# EAGLE design mainBoard (EAGLE 9.0.1)

## Sheet 1 of 4
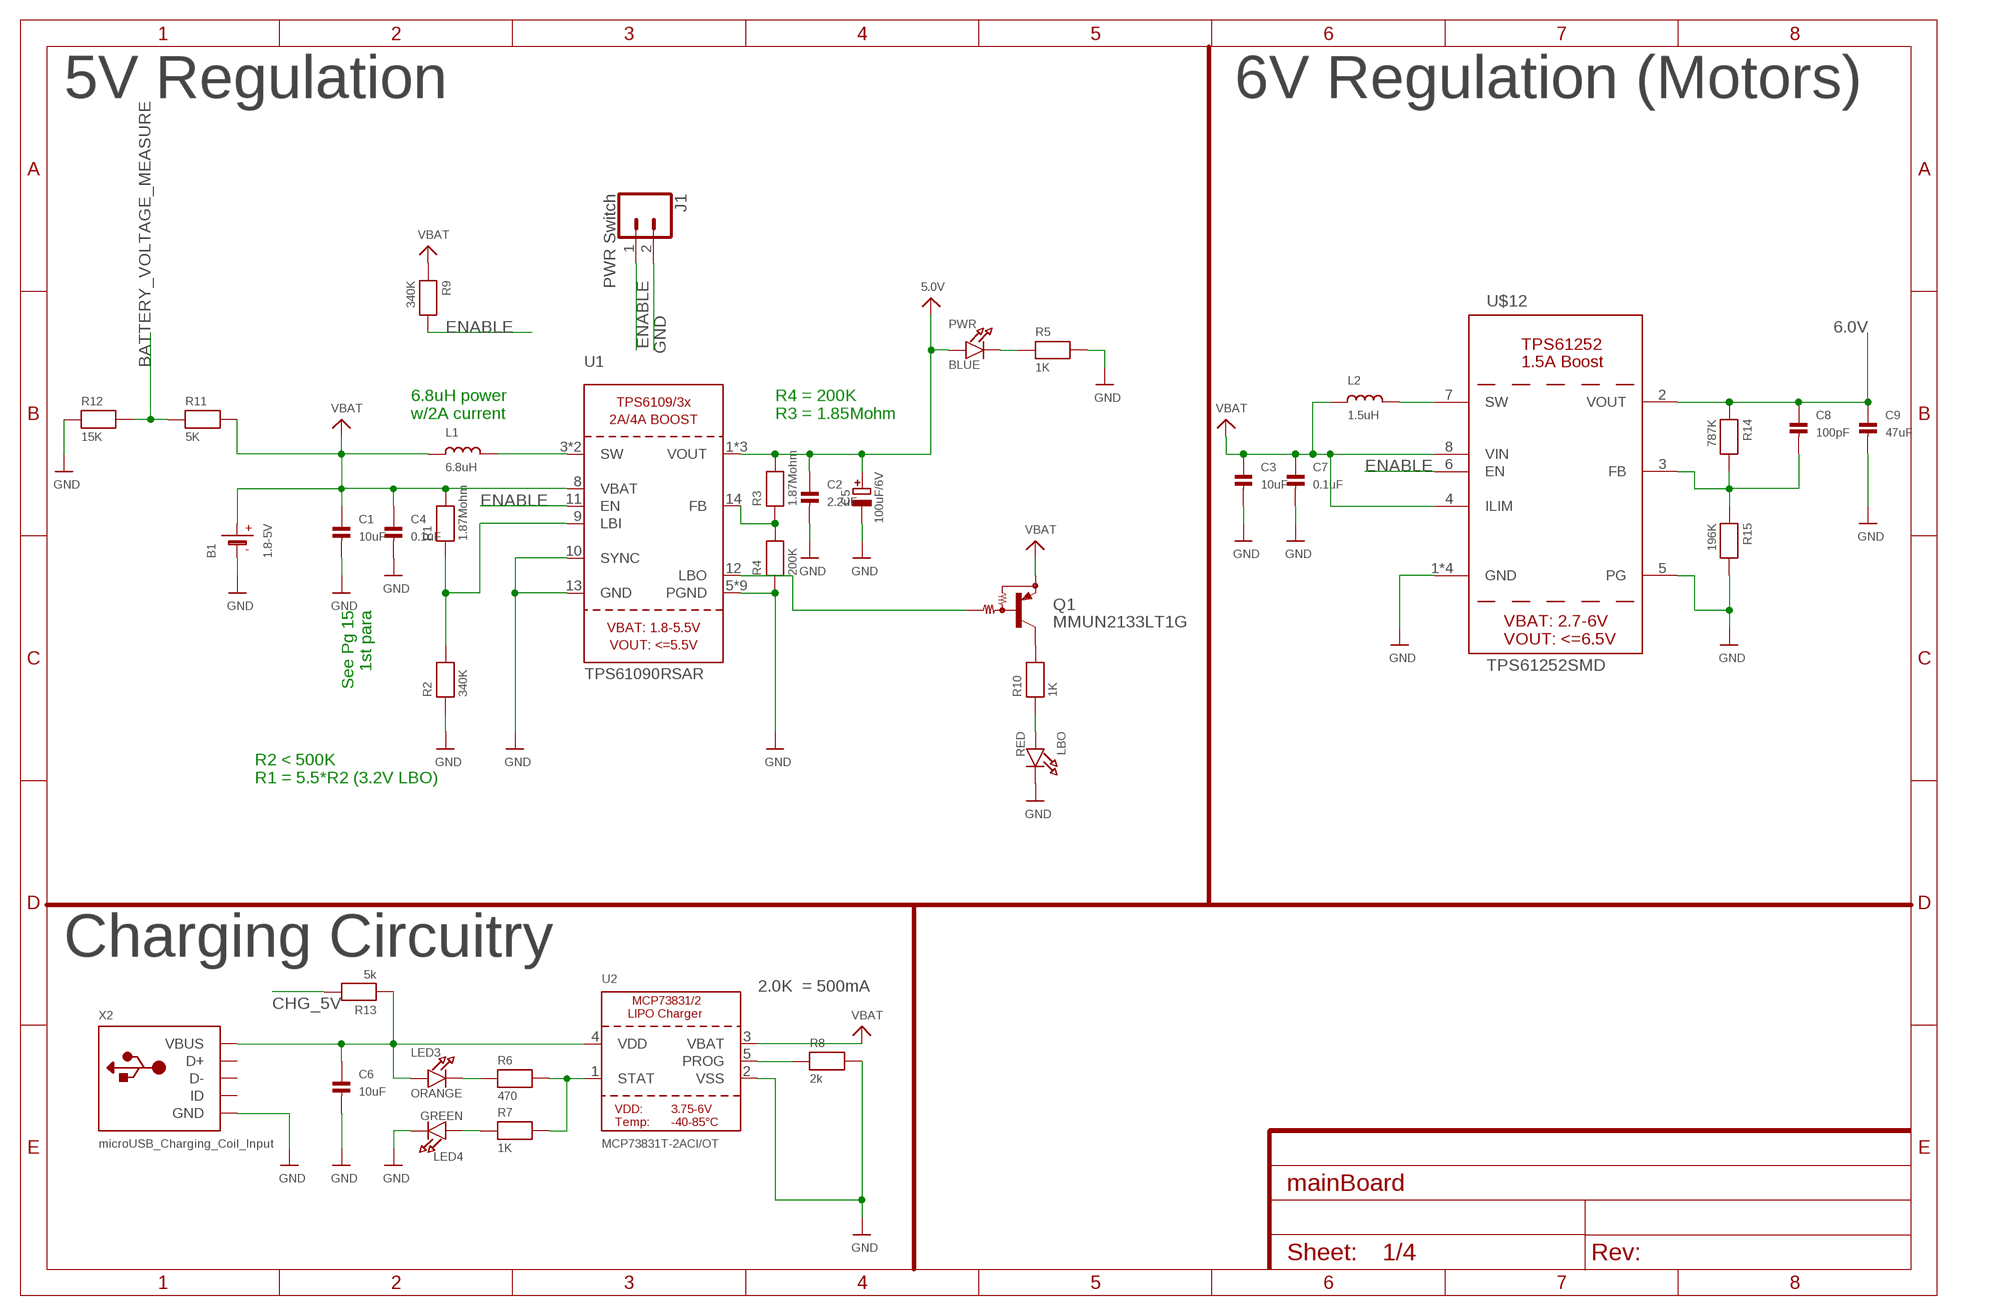
[diagram p0: schematic, sheet 1]
FRAME1 (FRAME-A4L): CNAME: Charging and Power Distribution; CREVISION: 1; DESIGNER: Sean Wilson

### Parts
B1  1.8-5V  BATTERY  [JSTPH2]
C1  10uF  CAP_CERAMIC0603  [0603]
C2  2.2uF  CAP_CERAMIC0603  [0603]
C3  10uF  CAP_CERAMIC0603  [0603]
C4  0.1uF  CAP_CERAMIC0805  [0805]
C5  100uF/6V  CAP_TANTALUMB/3528_REFLOW  [EIA3528-21/B-R]
C6  10uF  CAP_CERAMIC0603  [0603]
C7  0.1uF  CAP_CERAMIC0805  [0805]
C8  100pF  CAP_CERAMIC0603  [0603]
C9  47uF  CAP_CERAMIC1206  [1206]
J1  PWR Switch  CONN_02  [1X02]
L1  6.8uH  VISHAY_IHLP2525CZER6R8M01  [VISHAY_IHLP2525CZER6R8M01]
L2  1.5uH  MURATA_DFE252012P-1R5M=P2  [MURATA_DFE252012P-1R5M=P2]
LBO  RED  LED0805_NOOUTLINE  [CHIPLED_0805_NOOUTLINE]
LED3  ORANGE  LED0805_NOOUTLINE  [CHIPLED_0805_NOOUTLINE]
LED4  GREEN  LED0805_NOOUTLINE  [CHIPLED_0805_NOOUTLINE]
PWR  BLUE  LED0805_NOOUTLINE  [CHIPLED_0805_NOOUTLINE]
Q1  MMUN2133LT1G  MUN2114T1-PNP_DRIVER-SC59-BEC  [SC59-BEC]
R1  1.87Mohm  RESISTOR0805  [0805]
R2  340K  RESISTOR0805  [0805]
R3  1.87Mohm  RESISTOR0805  [0805]
R4  200K  RESISTOR0805  [0805]
R5  1K  RESISTOR0805  [0805]
R6  470  RESISTOR0805  [0805]
R7  1K  RESISTOR0805  [0805]
R8  2k  RESISTOR0805  [0805]
R9  340K  RESISTOR0805  [0805]
R10  1K  RESISTOR0805  [0805]
R11  5K  RESISTOR0805  [0805]
R12  15K  RESISTOR0805  [0805]
R13  5k  RESISTOR0805  [0805]
R14  787K  RESISTOR0805  [0805]
R15  196K  RESISTOR0805  [0805]
U1  TPS61090RSAR  VREG_TPS6103X  [PVQFN-16]
U2  MCP73831T-2ACI/OT  MCP73831/2  [SOT23-5]
U$12  TPS61252SMD  [TPS61252]
X2  microUSB_Charging_Coil_Input  USBMICRO_20329  [4UCONN_20329]

### Nets
5.0V: C2.1 C5.+ PWR.A R3.2 U1.1(VOUT) U1.15(VOUT) U1.16(VOUT) ; also sheet 2,3,4
6.0V: C8.1 C9.1 R14.1 U$12.2(VOUT) ; also sheet 3
BATTERY_VOLTAGE_MEASURE: R11.1 R12.2 ; also sheet 2
CHARGING_BOOL_5V: C6.1 LED3.A R13.1 U2.4(VDD) X2.VBUS
CHG_5V: R13.2 ; also sheet 2
ENABLE: J1.1 R9.2 U1.11(EN) U$12.6(EN)
GND: B1.1(-) C1.2 C2.2 C3.2 C4.2 C5.- C6.2 C7.2 C9.2 J1.2 LBO.C LED4.C R2.1 R4.1 R5.2 R8.2 R12.1 R15.2 U1.5(PGND) U1.6(PGND) U1.7(PGND) U1.10(SYNC) U1.13(GND) U1.P$18(PGND) U1.P$19(PGND) U1.P$20(PGND) U1.P$21(PGND) U1.P$22(PGND) U1.THERMAL(PGND) U2.2(VSS) U$12.1(GND) U$12.5(PG) U$12.P$2_GND(GND) U$12.P$3_GND(GND) U$12.THERMAL_GND(GND) X2.BASE@1(GND) X2.BASE@2(GND) X2.GND X2.SPRT@1(GND) X2.SPRT@2(GND) X2.SPRT@3(GND) X2.SPRT@4(GND) ; also sheet 2,3,4
LBO: Q1.B U1.12(LBO)
N$1: L1.P$2 U1.3(SW) U1.4(SW)
N$2: LBO.A R10.1
N$3: R1.1 R2.2 U1.9(LBI)
N$4: PWR.C R5.1
N$5: R3.1 R4.2 U1.14(FB)
N$6: LED3.C R6.1
N$7: R6.2 R7.2 U2.1(STAT)
N$8: R8.1 U2.5(PROG)
N$9: LED4.A R7.1
N$10: Q1.C R10.2
N$11: L2.P$2 U$12.7(SW)
N$12: C8.2 R14.2 R15.1 U$12.3(FB)
VBAT: B1.2(+) C1.1 C3.1 C4.1 C7.1 L1.P$1 L2.P$1 Q1.E R1.2 R9.1 R11.2 U1.8(VBAT) U2.3(VBAT) U$12.4(ILIM) U$12.8(VIN)
Unconnected: X2.D+ X2.D- X2.ID

### Notes on the sheet
- 5V Regulation | 6V Regulation (Motors)
- 6.8uH power
  w/2A current
- R4 = 200K
  R3 = 1.85Mohm
- See Pg 15
  1st para
- R2 < 500K
  R1 = 5.5*R2 (3.2V LBO)
- Charging Circuitry
- 2.0K  = 500mA

## Sheet 2 of 4
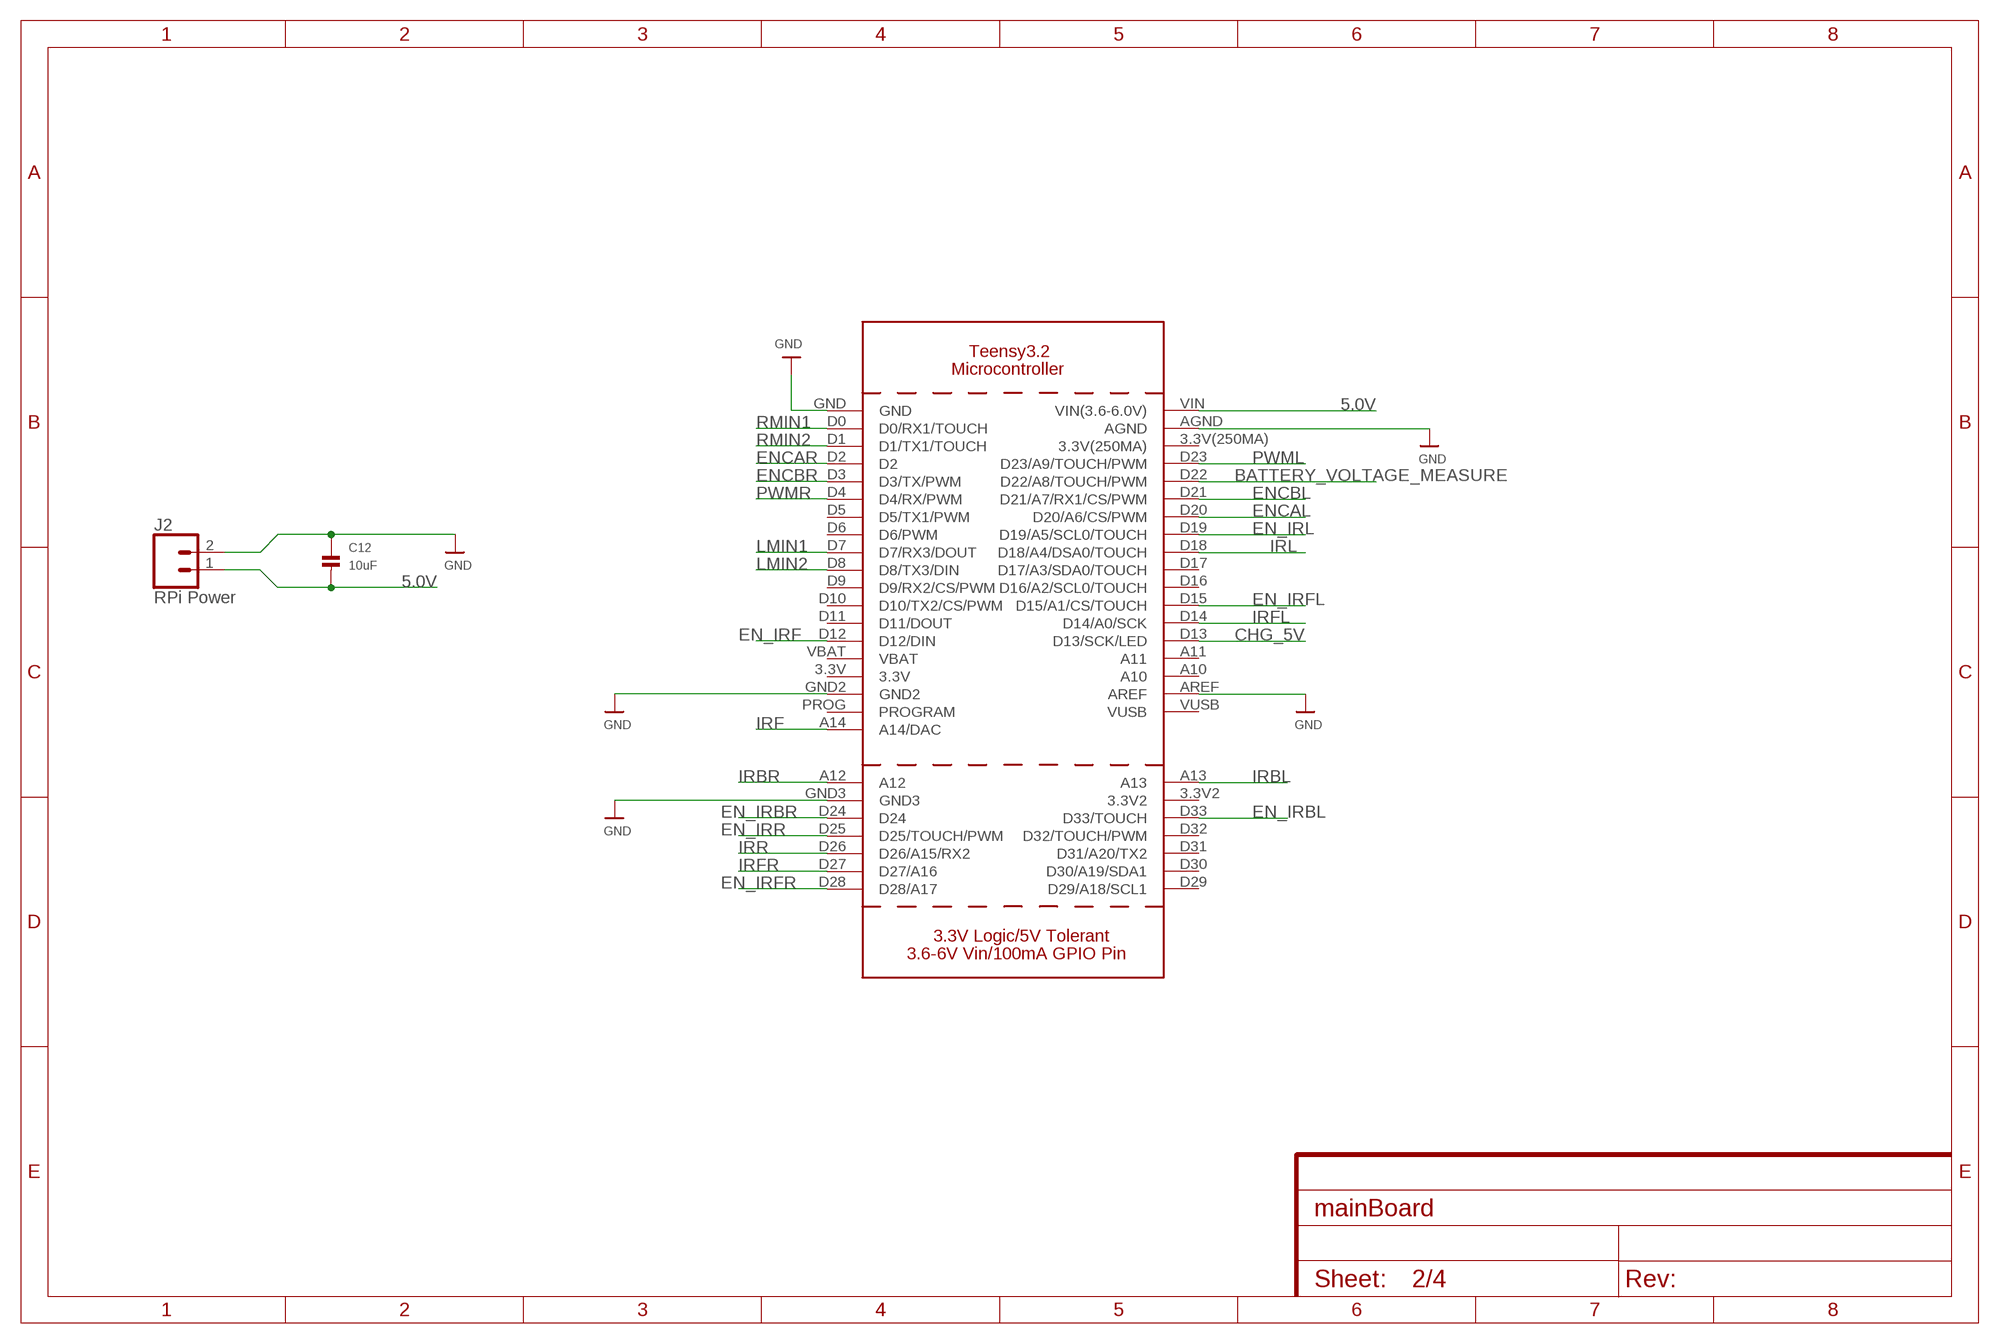
[diagram p1: schematic, sheet 2]
FRAME2 (FRAME-A4L): CNAME: Main Processor; CREVISION: 1; DESIGNER: Sean Wilson

### Parts
C12  10uF  CAP_CERAMIC0603  [0603]
J2  RPi Power  CONN_02  [1X02]
U$28  TEENSY3_2  [TEENSY3_2]

### Nets
5.0V: C12.2 J2.1 U$28.VIN(VIN(3.6-6.0V)) ; also sheet 1,3,4
BATTERY_VOLTAGE_MEASURE: U$28.D22(D22/A8/TOUCH/PWM) ; also sheet 1
CHG_5V: U$28.D13(D13/SCK/LED) ; also sheet 1
EN_IRBL: U$28.D33(D33/TOUCH) ; also sheet 4
EN_IRBR: U$28.D24 ; also sheet 4
EN_IRF: U$28.D12(D12/DIN) ; also sheet 4
EN_IRFL: U$28.D15(D15/A1/CS/TOUCH) ; also sheet 4
EN_IRFR: U$28.D28(D28/A17) ; also sheet 4
EN_IRL: U$28.D19(D19/A5/SCL0/TOUCH) ; also sheet 4
EN_IRR: U$28.D25(D25/TOUCH/PWM) ; also sheet 4
ENCAL: U$28.D20(D20/A6/CS/PWM) ; also sheet 3
ENCAR: U$28.D2 ; also sheet 3
ENCBL: U$28.D21(D21/A7/RX1/CS/PWM) ; also sheet 3
ENCBR: U$28.D3(D3/TX/PWM) ; also sheet 3
GND: C12.1 J2.2 U$28.AGND U$28.AREF U$28.GND U$28.GND2 U$28.GND3 ; also sheet 1,3,4
IRBL: U$28.A13 ; also sheet 4
IRBR: U$28.A12 ; also sheet 4
IRF: U$28.A14(A14/DAC) ; also sheet 4
IRFL: U$28.D14(D14/A0/SCK) ; also sheet 4
IRFR: U$28.D27(D27/A16) ; also sheet 4
IRL: U$28.D18(D18/A4/DSA0/TOUCH) ; also sheet 4
IRR: U$28.D26(D26/A15/RX2) ; also sheet 4
LMIN1: U$28.D7(D7/RX3/DOUT) ; also sheet 3
LMIN2: U$28.D8(D8/TX3/DIN) ; also sheet 3
PWML: U$28.D23(D23/A9/TOUCH/PWM) ; also sheet 3
PWMR: U$28.D4(D4/RX/PWM) ; also sheet 3
RMIN1: U$28.D0(D0/RX1/TOUCH) ; also sheet 3
RMIN2: U$28.D1(D1/TX1/TOUCH) ; also sheet 3
Unconnected: U$28.3.3V U$28.3.3V2 U$28.3.3V(250MA) U$28.A10 U$28.A11 U$28.D5(D5/TX1/PWM) U$28.D6(D6/PWM) U$28.D9(D9/RX2/CS/PWM) U$28.D10(D10/TX2/CS/PWM) U$28.D11(D11/DOUT) U$28.D16(D16/A2/SCL0/TOUCH) U$28.D17(D17/A3/SDA0/TOUCH) U$28.D29(D29/A18/SCL1) U$28.D30(D30/A19/SDA1) U$28.D31(D31/A20/TX2) U$28.D32(D32/TOUCH/PWM) U$28.PROG(PROGRAM) U$28.VBAT U$28.VUSB

## Sheet 3 of 4
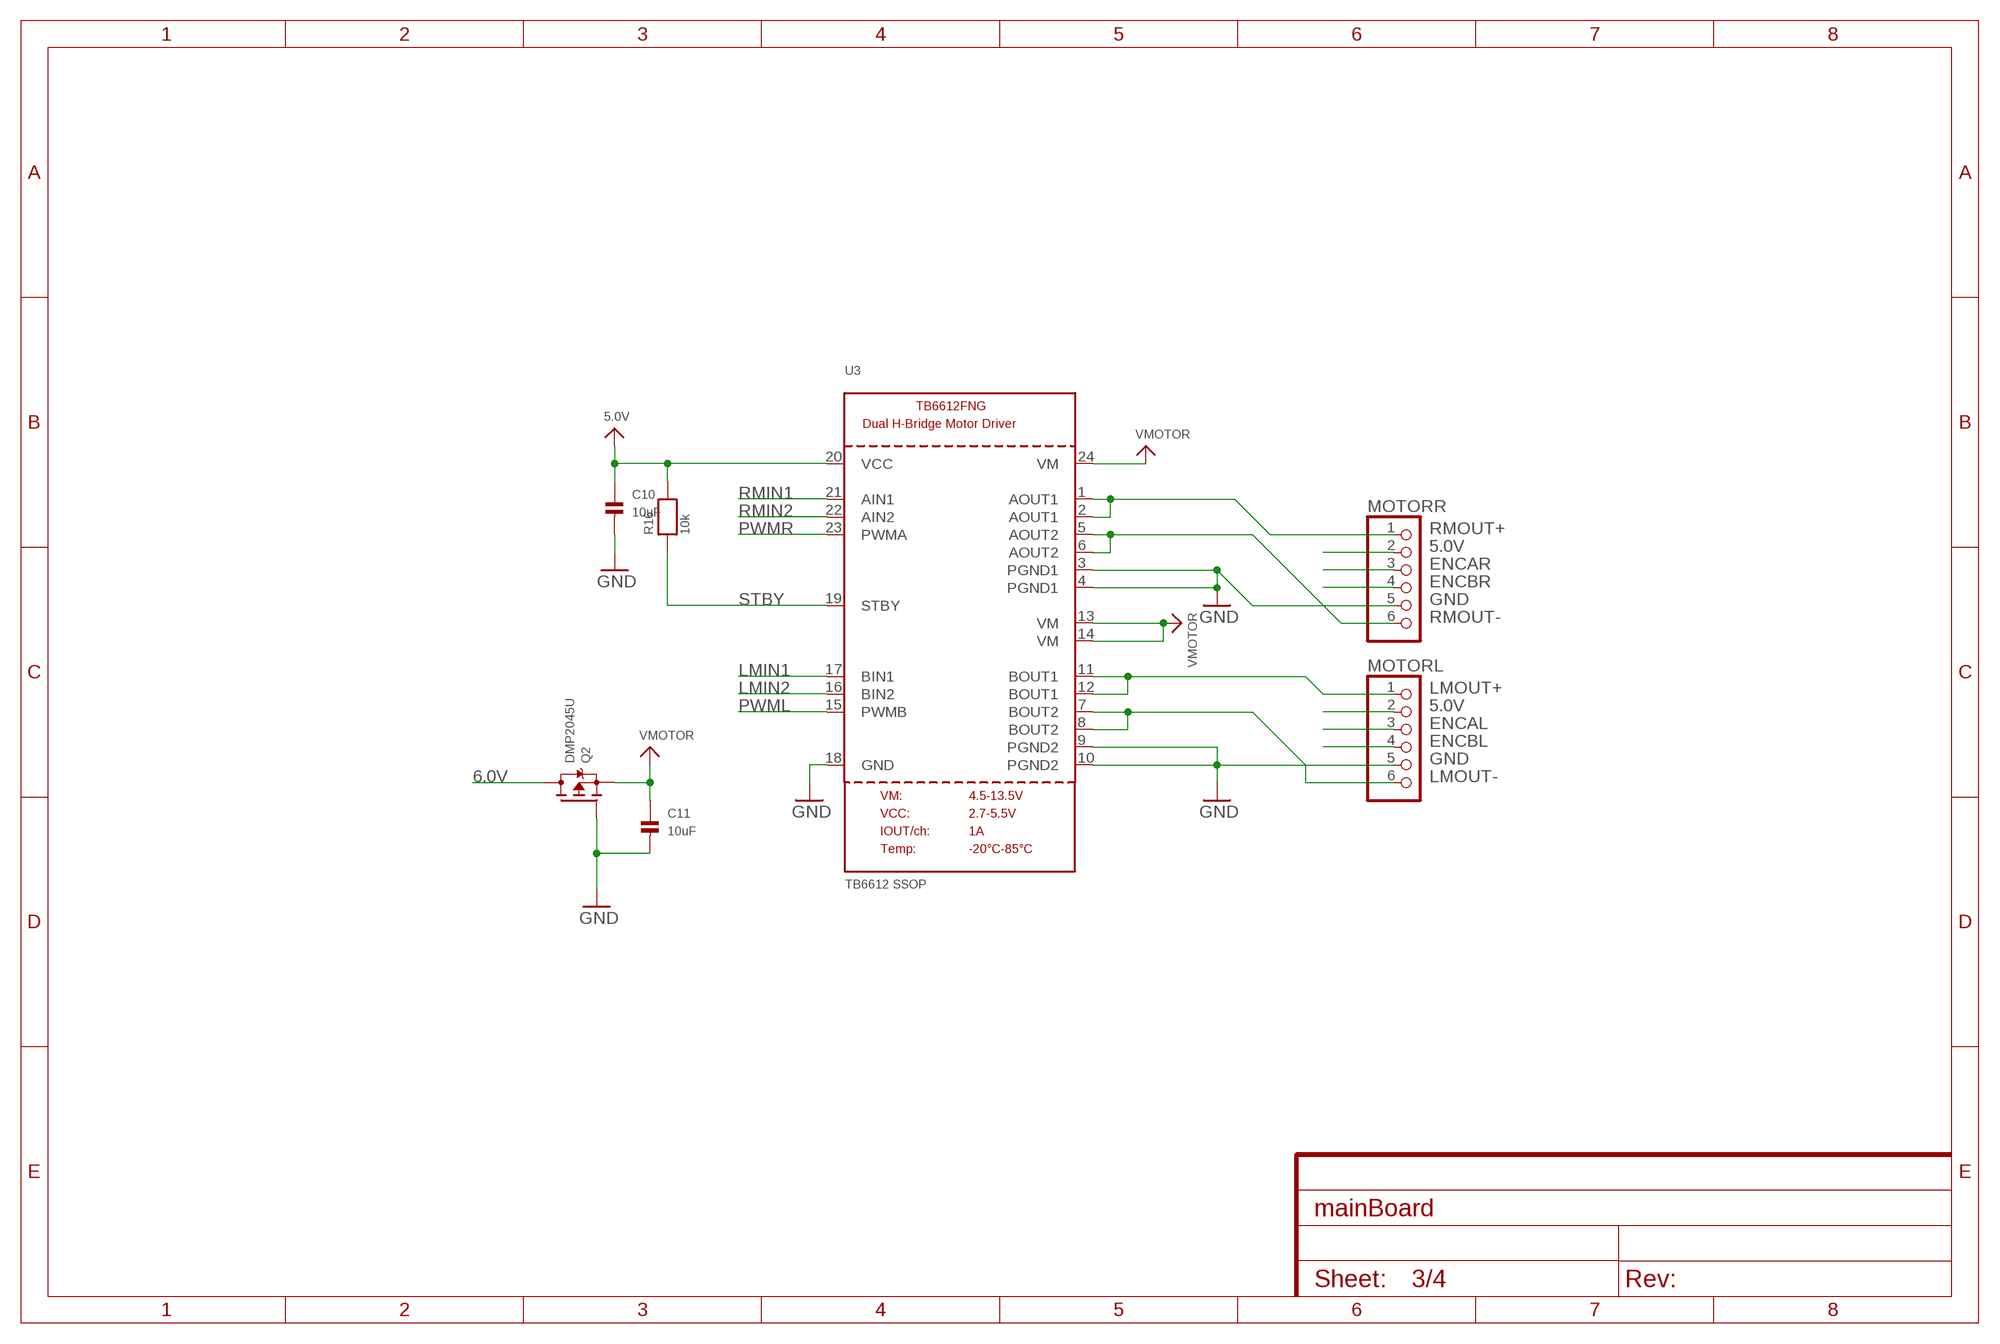
[diagram p2: schematic, sheet 3]
FRAME3 (FRAME-A4L): CNAME: Motor Driver; CREVISION: 1; DESIGNER: Sean Wilson

### Parts
C10  10uF  CAP_CERAMIC0603  [0603]
C11  10uF  CAP_CERAMIC0603  [0603]
MOTORL  PINHD-1X6CB  [1X06-CLEANBIG]
MOTORR  PINHD-1X6CB  [1X06-CLEANBIG]
Q2  DMP2045U  MOSFET-PWIDE  [SOT23-WIDE]
R16  10k  RESISTOR0805  [0805]
U3  TB6612 SSOP  TB6612FNGSSOP  [SSOP24]

### Nets
5.0V: C10.1 MOTORL.2 MOTORR.2 R16.2 U3.20(VCC) ; also sheet 1,2,4
6.0V: Q2.3(D) ; also sheet 1
ENCAL: MOTORL.3 ; also sheet 2
ENCAR: MOTORR.3 ; also sheet 2
ENCBL: MOTORL.4 ; also sheet 2
ENCBR: MOTORR.4 ; also sheet 2
GND: C10.2 C11.2 MOTORL.5 MOTORR.5 Q2.1(G) U3.3(PGND1) U3.4(PGND1) U3.9(PGND2) U3.10(PGND2) U3.18(GND) ; also sheet 1,2,4
LMIN1: U3.17(BIN1) ; also sheet 2
LMIN2: U3.16(BIN2) ; also sheet 2
LMOUT+: MOTORL.1 U3.11(BOUT1) U3.12(BOUT1)
LMOUT-: MOTORL.6 U3.7(BOUT2) U3.8(BOUT2)
PWML: U3.15(PWMB) ; also sheet 2
PWMR: U3.23(PWMA) ; also sheet 2
RMIN1: U3.21(AIN1) ; also sheet 2
RMIN2: U3.22(AIN2) ; also sheet 2
RMOUT+: MOTORR.1 U3.1(AOUT1) U3.2(AOUT1)
RMOUT-: MOTORR.6 U3.5(AOUT2) U3.6(AOUT2)
STBY: R16.1 U3.19(STBY)
VMOTOR: C11.1 Q2.2(S) U3.13(VM) U3.14(VM) U3.24(VM)

## Sheet 4 of 4
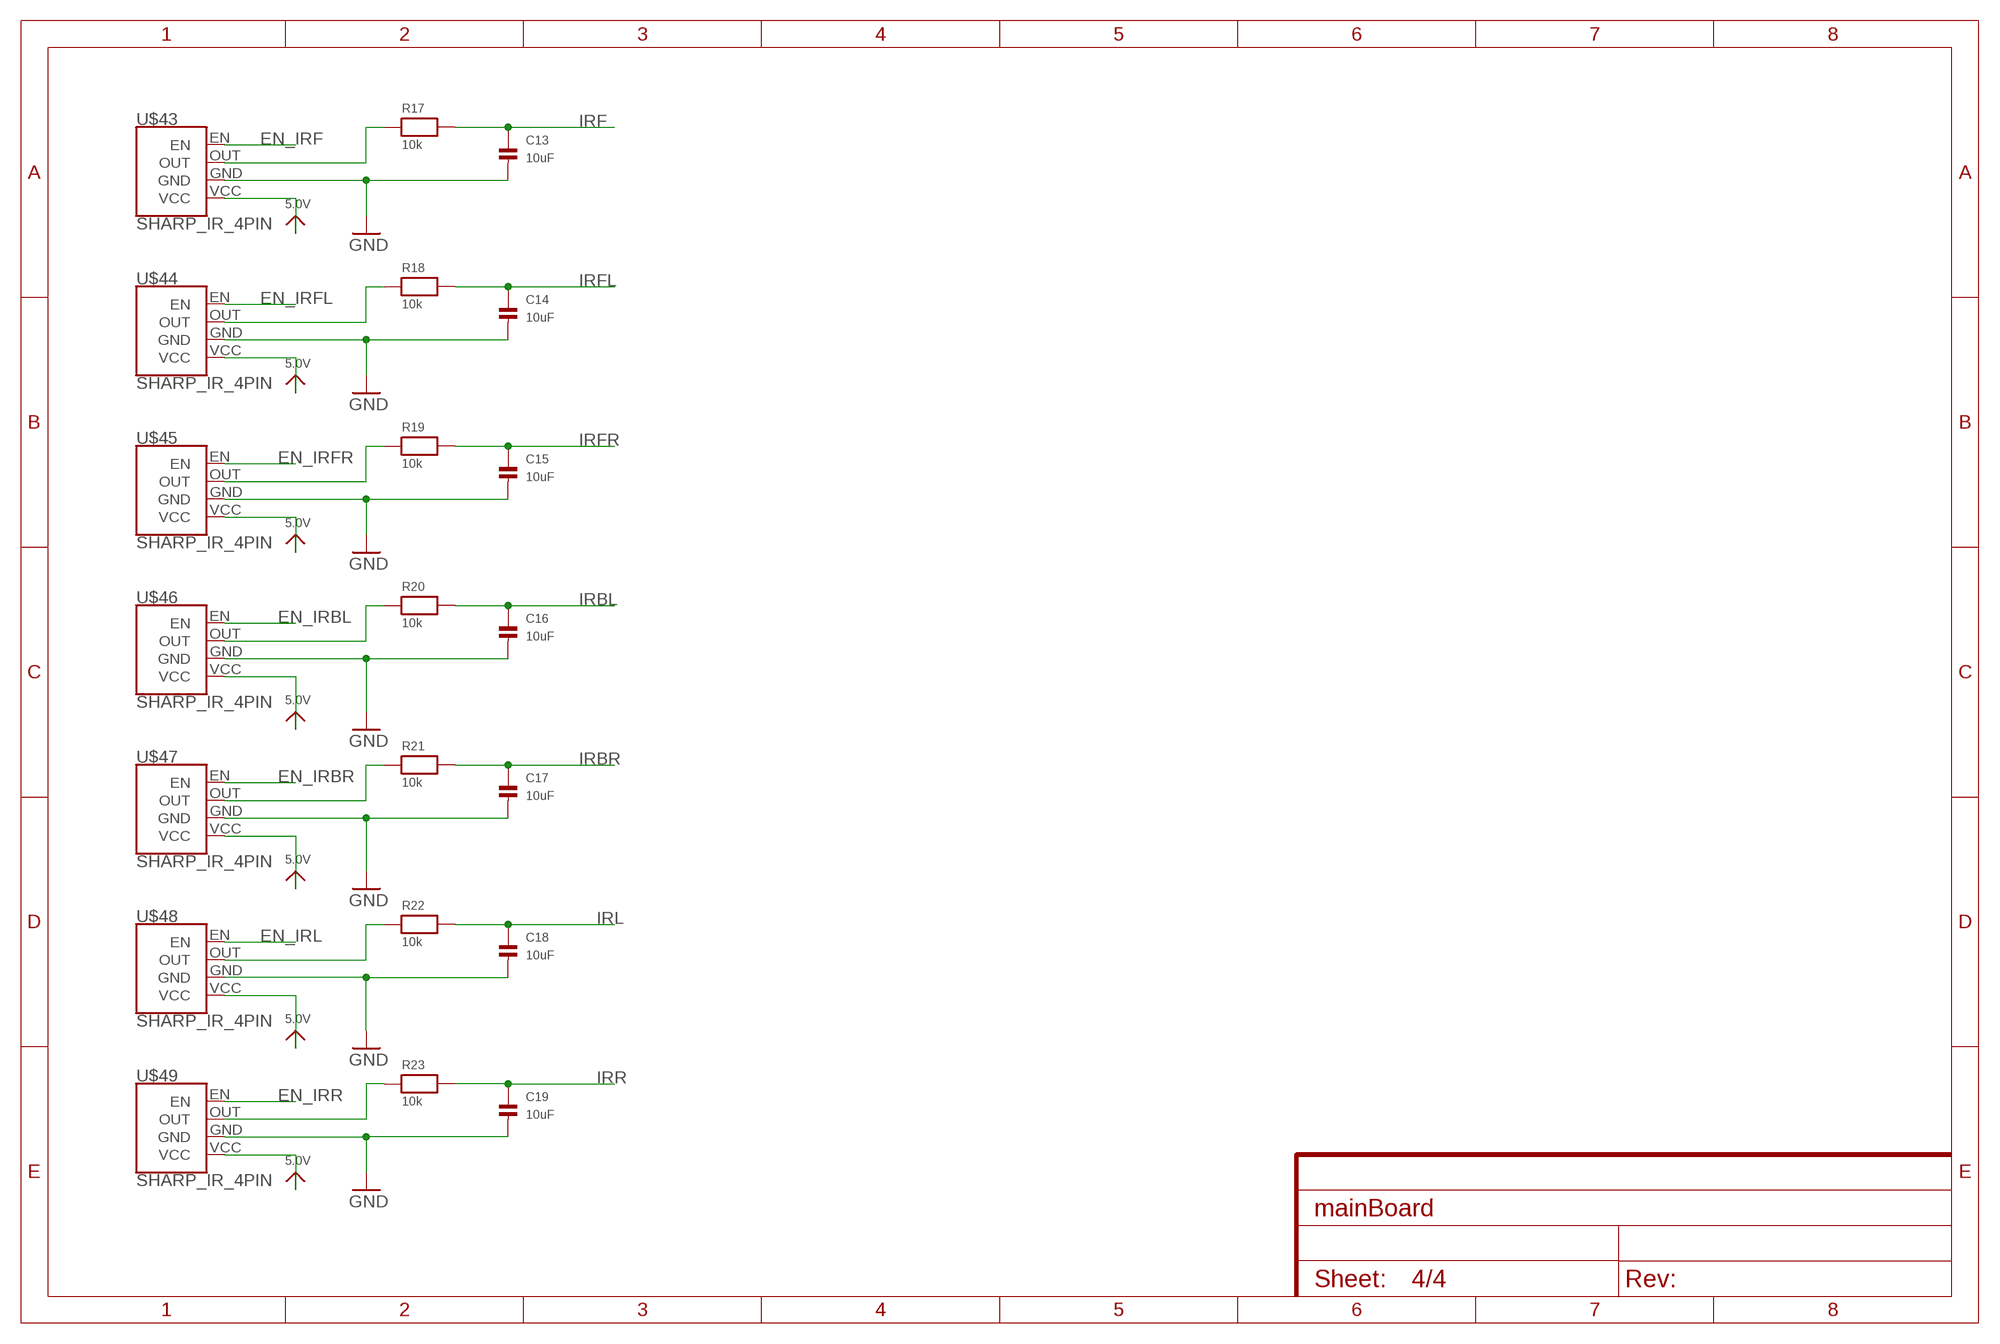
[diagram p3: schematic, sheet 4]
FRAME4 (FRAME-A4L): CNAME: IR Sensors/IMU; CREVISION: 1; DESIGNER: Sean Wilson

### Parts
C13  10uF  CAP_CERAMIC0603  [0603]
C14  10uF  CAP_CERAMIC0603  [0603]
C15  10uF  CAP_CERAMIC0603  [0603]
C16  10uF  CAP_CERAMIC0603  [0603]
C17  10uF  CAP_CERAMIC0603  [0603]
C18  10uF  CAP_CERAMIC0603  [0603]
C19  10uF  CAP_CERAMIC0603  [0603]
R17  10k  RESISTOR0805  [0805]
R18  10k  RESISTOR0805  [0805]
R19  10k  RESISTOR0805  [0805]
R20  10k  RESISTOR0805  [0805]
R21  10k  RESISTOR0805  [0805]
R22  10k  RESISTOR0805  [0805]
R23  10k  RESISTOR0805  [0805]
U$43  SHARP_IR_4PIN  [SHARP_IR_4PIN]
U$44  SHARP_IR_4PIN  [SHARP_IR_4PIN]
U$45  SHARP_IR_4PIN  [SHARP_IR_4PIN]
U$46  SHARP_IR_4PIN  [SHARP_IR_4PIN]
U$47  SHARP_IR_4PIN  [SHARP_IR_4PIN]
U$48  SHARP_IR_4PIN  [SHARP_IR_4PIN]
U$49  SHARP_IR_4PIN  [SHARP_IR_4PIN]

### Nets
5.0V: U$43.VCC U$44.VCC U$45.VCC U$46.VCC U$47.VCC U$48.VCC U$49.VCC ; also sheet 1,2,3
EN_IRBL: U$46.EN ; also sheet 2
EN_IRBR: U$47.EN ; also sheet 2
EN_IRF: U$43.EN ; also sheet 2
EN_IRFL: U$44.EN ; also sheet 2
EN_IRFR: U$45.EN ; also sheet 2
EN_IRL: U$48.EN ; also sheet 2
EN_IRR: U$49.EN ; also sheet 2
GND: C13.2 C14.2 C15.2 C16.2 C17.2 C18.2 C19.2 U$43.GND U$44.GND U$45.GND U$46.GND U$47.GND U$48.GND U$49.GND ; also sheet 1,2,3
IRBL: C16.1 R20.2 ; also sheet 2
IRBR: C17.1 R21.2 ; also sheet 2
IRF: C13.1 R17.2 ; also sheet 2
IRFL: C14.1 R18.2 ; also sheet 2
IRFR: C15.1 R19.2 ; also sheet 2
IRL: C18.1 R22.2 ; also sheet 2
IRR: C19.1 R23.2 ; also sheet 2
N$14: R23.1 U$49.OUT
N$16: R22.1 U$48.OUT
N$19: R21.1 U$47.OUT
N$22: R20.1 U$46.OUT
N$26: R19.1 U$45.OUT
N$29: R18.1 U$44.OUT
N$32: R17.1 U$43.OUT

## Library data of the parts
B1 = microbuilder:BATTERY: CR1220 SMT - Digikey: 3001K-ND CD2032 BAT-HLD-001 - Digikey: BAT-HLD-001-ND
C1-C4 C6-C19 = microbuilder:CAP_CERAMIC: Ceramic Capacitors 0402 - 0402 Surface Mount Capacitors 16pF 50V 5% [Digikey: 445-4899-2-ND] 18pF 50V 5% [Digikey: 490-1281-2-ND] 22pF 50V 5% [Digikey: 490-1283-2-ND] 68pF 50V 5% [Digikey: 490-1289-2-ND] 0.1uF 10V 10% [Digikey: 490-1318-2-ND] 1.0uF 6.3V 10% [Digikey: 490-1320-2-ND] 0603 - 0603 Surface Mount Capacitors 16 pF 50V 5% [Digikey: 445-5051-2-ND] 22 pF 50V [Digikey: PCC220ACVTR-ND] 33 pF 50V 5% [Digikey: 490-1415-1-ND] 56pF 50V 5% [Digikey: 490-1421-1-ND] 220pF 50V 5% [Digikey: 445-1285-1-ND] 680 pF 50V 2200 pF 50V 5% C0G [Digikey: 445-1297-1-ND] 5600 pF 100V 5% X7R [Digikey: 478-3711-1-ND] 0.1 µF 25V 10% [Digikey: PCC2277TR-ND] 0.22 µF 16V 10% X7R [Digikey: 445-1318-1-ND] 1.0 µF 25V 10% [Digikey: 445-5146-2-ND] 0603 - RF Specific 3pF 250V +/-0.1pF RF [Digikey: 712-1347-1-ND] 18 pF 250V 5% [Digikey: 478-3505-1-ND or 712-1322-1-ND] 56 pF 250V 5% C0G RF [Digikey: 490-4867-1-ND] 68 pF 250V RF [Digikey: 490-4868-1-ND] 0805 - 0805 Surface Mount Capacitors 220 pF 250V 2% RF Ceramic Capacitor [Digikey: 712-1398-1-ND] 1000 pF 50V 2% NP0 Ceramic Capacitor [Digikey: 478-3760-1-ND] 0.1 µF 25V 10% Ceramic Capacitor [Digikey: PCC1828TR-ND] 1.0 µF 16V 10% Ceramic Capacitor[Digikey: 490-1691-2-ND] 10.0 µF 10V 10% Ceramic Capacitor[Digikey: 709-1228-1-ND] 10.0 uF 16V 10% Ceramic Capacitor [Digikey: 478-5165-2-ND] 47 uF 6.3V 20% Ceramic Capacitor [Digikey: 587-1779-1-ND or 399-5506-1-ND] 1206 - 1206 Surface Mount Capacitors 47uF 10V 20% Ceramic Capacitor [Digikey: 490-5528-1-ND or 399-5508-1-ND or 445-6010-1-ND] 100uF 6.3V -20%, +80% Y5V Ceramic Capacitor (Digikey: 490-4512-1-ND, Mouser: 81-GRM31CF50J107ZE1L)
C5 = microbuilder:CAP_TANTALUM: Tantalum Capacitors Wave footprints have larger pads and are meant to be used for hand soldering. Reflow footprints are optimised for solder paste and a reflow oven. EIA3216-18/A-[R/W] - Size A / 3216-18 / 1206 footprint 4.7µF 25V 10% Tantalum Capacitor 10µF 16V 10% Tantalum Capacitor [Digikey: 495-2236-2-ND] EIA3528-21/B-[R/W] - Size B / 3528-21 47µF 10V 10% Tantalum Capactior [Digikey: 495-2216-1-ND] EIA6032-28/C-[R/W] - Size C / 6032-28 10µF 35V 20% Tantalum Capacitor [Digikey: 495-2285-1-ND] 100µF 16V 10% Tantalum Capactior [Digikey: 399-5214-1-ND]
J1 J2 = SparkFun-Connectors:CONN_02: Multi connection point. Often used as Generic Header-pin footprint for 0.1 inch spaced/style header connections On any of the 0.1 inch spaced packages, you can populate with these: Break Away Headers - Straight <https://www.sparkfun.com/products/116> (PRT-00116) Break Away Male Headers - Right Angle <https://www.sparkfun.com/products/553> (PRT-00553) Female Headers <https://www.sparkfun.com/products/115> (PRT-00115) Break Away Headers - Machine Pin <https://www.sparkfun.com/products/117> (PRT-00117) Break Away Female Headers - Swiss Machine Pin <https://www.sparkfun.com/products/743> (PRT-00743) For SCREWTERMINALS and SPRING TERMINALS visit here: Screw Terimnals on SparkFun.com <https://www.sparkfun.com/search/results?term=Screw+Terminals> (5mm/3.5mm/2.54mm spacing) This device is also useful as a general connection point to wire up your design to another part of your project. Our various solder wires solder well into these plated through hole pads. Hook-Up Wire - Assortment (Stranded, 22 AWG) <https://www.sparkfun.com/products/11375> (PRT-11375) Hook-Up Wire - Assortment (Solid Core, 22 AWG) <https://www.sparkfun.com/products/11367> (PRT-11367) View the entire wire category on our website here <https://www.sparkfun.com/categories/141> Special notes: Molex polarized connector foot print use with: PRT-08233 with associated crimp pins and housings. 2.54_SCREWTERM for use with PRT-10571. 3.5mm Screw Terminal footprints for PRT-08084 5mm Screw Terminal footprints for use with PRT-08432
L1 = gritsbotx_electronics:VISHAY_IHLP2525CZER6R8M01
L2 = gritsbotx_electronics:MURATA_DFE252012P-1R5M=P2
LBO LED3 LED4 PWR = microbuilder:LED: LED 0603 - 0603 Surface Mount Package 2mA: Green LED - Low Power (3.9mcd, 2ma, 1.7Vf) - Digikey: 475-2709-2-ND Orange LED - Low Power (9.8mcd, 2ma, 1.8Vf) - Digikey: 475-1194-2-ND Red LED - Low Power (5mcd, 2ma, 1.8Vf) - Digikey: 475-1195-2-ND Yellow LED - Low Power (7mcd, 2ma, 1.8Vf) - Digikey: 475-1196-2-ND 5mA: Blue LED - Low Power (17mcd, 5ma, 2.9Vf) - Digikey: LNJ937W8CRACT-ND 0805 - 0805 Surface Mount Package 2mA: Red LED (8.8mcd, 2mA, 1.8Vf, Clear) - Low Power [Digikey: 475-2510-1-ND] Green LED (5mcd, 2mA, 1.8Vf, Clear) - Low Power [Digikey: 475-2730-1-ND] Yellow LED (11.3mcd, 2mA, 1.8Vf, Clear) - Low Power [Digikey: 475-2555-1-ND] 20mA: Red LED (104mcd, 20mA, Diffused) - LS R976 [Digikey: 475-1278-6-ND] Red LED (12mcd, 20mA, 2.0Vf, Clear) - APT2012EC [Digikey: 754-1128-1-ND] Green LED (15mcd, 20mA, 2.2Vf, Clear) - APT2012GC [Digikey: 754-1131-1-ND] Orange LED (160mcd, 20mA, 2.1Vf, Clear) - APT2012SECK [Digikey: 754-1130-1-ND] 1206 - 1206 Surface Mount Package Green LED (26mcd, 20mA, Diffused) - LG N971 [Digikey: 475-1407-6-ND] Red LED (15mcd, 20mA, Diffused) - LH N974 [Digikey: 475-1416-6-ND] Cree - Cree High-Power Surface Mount LEDs XPEBWT-L1-0000-00D50 - White 111lm 350mA 2.9Vf 6200K 110° XTEAWT-00-0000-00000LEE3 - White 114lm 350mA 2.85Vf 5000K 115° Everlight - Everlight 45-21 Series Surface Mount LEDs 45-21/QK2C-B2832AC2CB2/2T - Warm White 2000mcd 20mA 3.25Vf 3050K 120° 45-21/LK2C-B38452C4CB2/2T - Nuetral White 2000mcd 20mA 3.25Vf 4150K 120° 45-21/LK2C-B50634C6CB2/2T - Cold White 2200mcd 20mA 3.25Vf 5650K 120° PLCC2 Reverse Mount LS T77K-J1L2-1-0-2-R18-Z - Red 11.25mcd 2mA 1.8Vf 630nm 120° LO T77K-L1M2-24-Z - Orange 19.6mcd 2mA 1.8Vf 606nm 120° LY T77K-K2M1-26-Z - Yellow 15.7mcd 2mA 1.8Vf 587nm 120°
MOTORL MOTORR = adafruit:PINHD-1X6: PIN HEADER
Q1 = transistor:*-PNP_DRIVER-: PNP Bias Resistor Transistor
Q2 = microbuilder:MOSFET-P: P-Channel Mosfet LEGEND VDS: Voltage Drain-Source ID: Drain Current RDS(ON): Drain-Source On-State Resistance VGS(TH): Gate-Source Threshold Voltage CISS: Drain-Source Input Capacitance SOT-23 Name VDS ID RDS(ON) VGS(TH) CISS Order Number IRLML5103 30V 760mA 600 mOhm -- 75pF @ 25V Digikey: IRLML5103PBFCT-ND IRLML6401 12V 4.3A 50 mOhm 950mV @ 250µA 830pF @ 10V Digikey: IRLML6401PBFTR-ND NTR0202PL 20V 400mA 800 mOhm 2.3V @ 250uA 70pF @ 5V Digikey: NTR0202PLT1GOSTR-ND NTR4101PT1G 20V 1.8A 85 mOhm 1.2V @ 250uA 675pF @ 10V Digikey: NTR4101PT1GOSCT-ND DMP2004K 20V 600mA 900 mOhm 1V @ 250uA 175pF @ 16V Digikey: DMP2004KDICT-ND PMV65XP 20V 3.9A 76 mOhm 950mV @ 1mA 725pF @ 20V Digikey: 568-2358-2-ND TO-252 Name VDS ID RDS(ON) VGS(TH) CISS Order Number AOD417 30V 25A 34 mOhm 3V @ 250µA 920pF @ 15V Digikey: 785-1106-2-ND
R1-R23 = microbuilder:RESISTOR: Resistors 0402 - 0402 Surface Mount Package 22 Ohm 1% 1/16W [Digikey: 311-22.0LRTR-ND] 33 Ohm 5% 1/16W 1.0K 5% 1/16W 1.5K 5% 1/16W 2.0K 1% 1/16W 10.0K 1% 1/16W [Digikey: 311-10.0KLRTR-ND] 10.0K 5% 1/16W [Digikey: RMCF0402JT10K0TR-ND] 12.1K 1% 1/16W [Digikey: 311-22.0LRTR-ND] 100.0K 5% 1/16W 0603 - 0603 Surface Mount Package 0 Ohm 1/10 Watt 1% Resistor 15 Ohm 1/10 Watt 1% Resistor 33 Ohm 1/10 Watt 1% Resistor 49.9 Ohm 1/10 Watt 1% Resistor 100 Ohm 1/10 Watt 1% Resistor 150 Ohm 1/10 Watt 1% Resistor 240 Ohm 1/10 Watt 1% Resistor 390 Ohm 1/10 Watt 1% Resistor 560 Ohm 1/10 Watt 1% Resistor 680 Ohm 1/10 Watt 1% Resistor 750 Ohm 1/10 Watt 1% Resistor 1.0K Ohm 1/10 Watt 1% Resistor 1.5K Ohm 1/10 Watt 1% Resistor 2.0K Ohm 1/10 Watt 1% Resistor 2.2K Ohm 1/10 Watt 1% Resistor 3.3K Ohm 1/10 Watt 1% Resistor 4.7K Ohm 1/10 Watt 1% Resistor 10.0K Ohm 1/10 Watt 1% Resistor 12.0K Ohm 1/10 Watt 1% Resistor 12.1K Ohm 1/10 Watt 1% Resistor 20.0K Ohm 1/10 Watt 1% Resistor 33.0K Ohm 1/10 Watt 1% Resistor 100.0K Ohm 1/10 Watt 1% Resistor 0805 - 0805 Surface Mount Package 0 Ohm 1/8 Watt 1% Resistor 33 Ohm 1/8 Watt 1% Resistor 100 Ohm 1/8 Watt 1% Resistor 150 Ohm 1/8 Watt 1% Resistor 200 Ohm 1/8 Watt 1% Resistor 240 Ohm 1/8 Watt 1% Resistor 330 Ohm 1/8 Watt 1% Resistor 390 Ohm 1/8 Watt 1% Resistor 470 Ohm 1/8 Watt 1% Resistor 1.0K Ohm 1/8 Watt 1% Resistor 1.5K Ohm 1/8 Watt 1% Resistor 2.0K Ohm 1/8 Watt 1% Resistor 4.7K Ohm 1/8 Watt 1% Resistor 5.1K Ohm 1/8 Watt 1% Resistor 5.6K Ohm 1/8 Watt 1% Resistor 10.0K Ohm 1/8 Watt 1% Resistor 22.0K Ohm 1/8 Watt 1% Resistor 33.0K Ohm 1/8 Watt 1% Resistor 100K Ohm 1/8 Watt 1% Resistor 1206 - 1206 Surface Mount Package 2012 - 2010 Surface Mount Package 0.11 Ohm 1/2 Watt 1% Resistor - Digikey: RHM.11UCT-ND
U1 = microbuilder:VREG_TPS6103X: TPS6103x 4A Boost - 1.8-5.5V Input, Adjustable Output to 5.5V
U2 = microbuilder:MCP73831/2: MCP73831/2 LIPO Charger VDD: 3.75 - 6V Temp -40 - 85°C Programmable Charge Rate: 15-500mA NOTE: STAT is a tri-state logic output on the MCP73831 and an open-drain output on the MCP73832. SOT23-5 with 4.2V output and tri-state logic on STAT = MCP73831T-2ACI/OT
U3 = microbuilder:TB6612FNG: TB6612FNG Dual H-Bridge Motor Driver
U$12 = gritsbotx_electronics:TPS61252: Texas Instrument 1.5-A Boost Converter With Adjustable Input Current Limit. (2.7 - 6V input range to 0 - 6.5V output)
U$28 = gritsbotx_electronics:TEENSY3_2
U$43-U$49 = gritsbotx_electronics:SHARP_IR_4PIN
X2 = microbuilder:USB: USB Connectors USBMINIB - Surface Mount Female Mini-B USB Connector 4UConnector: 06564

## Board
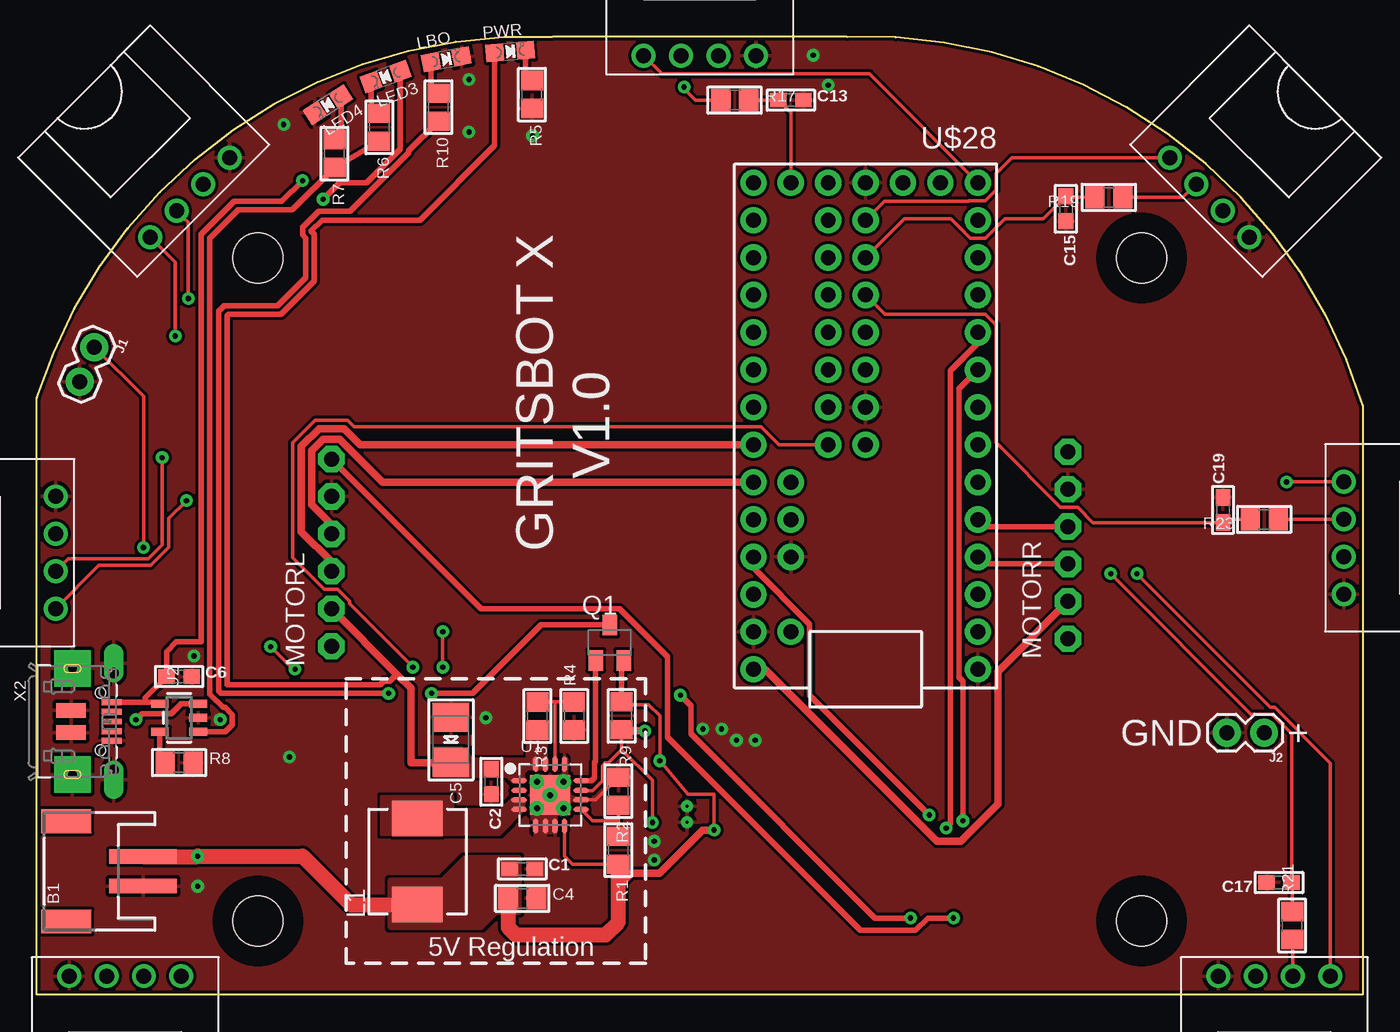
[diagram p4: board, top side]
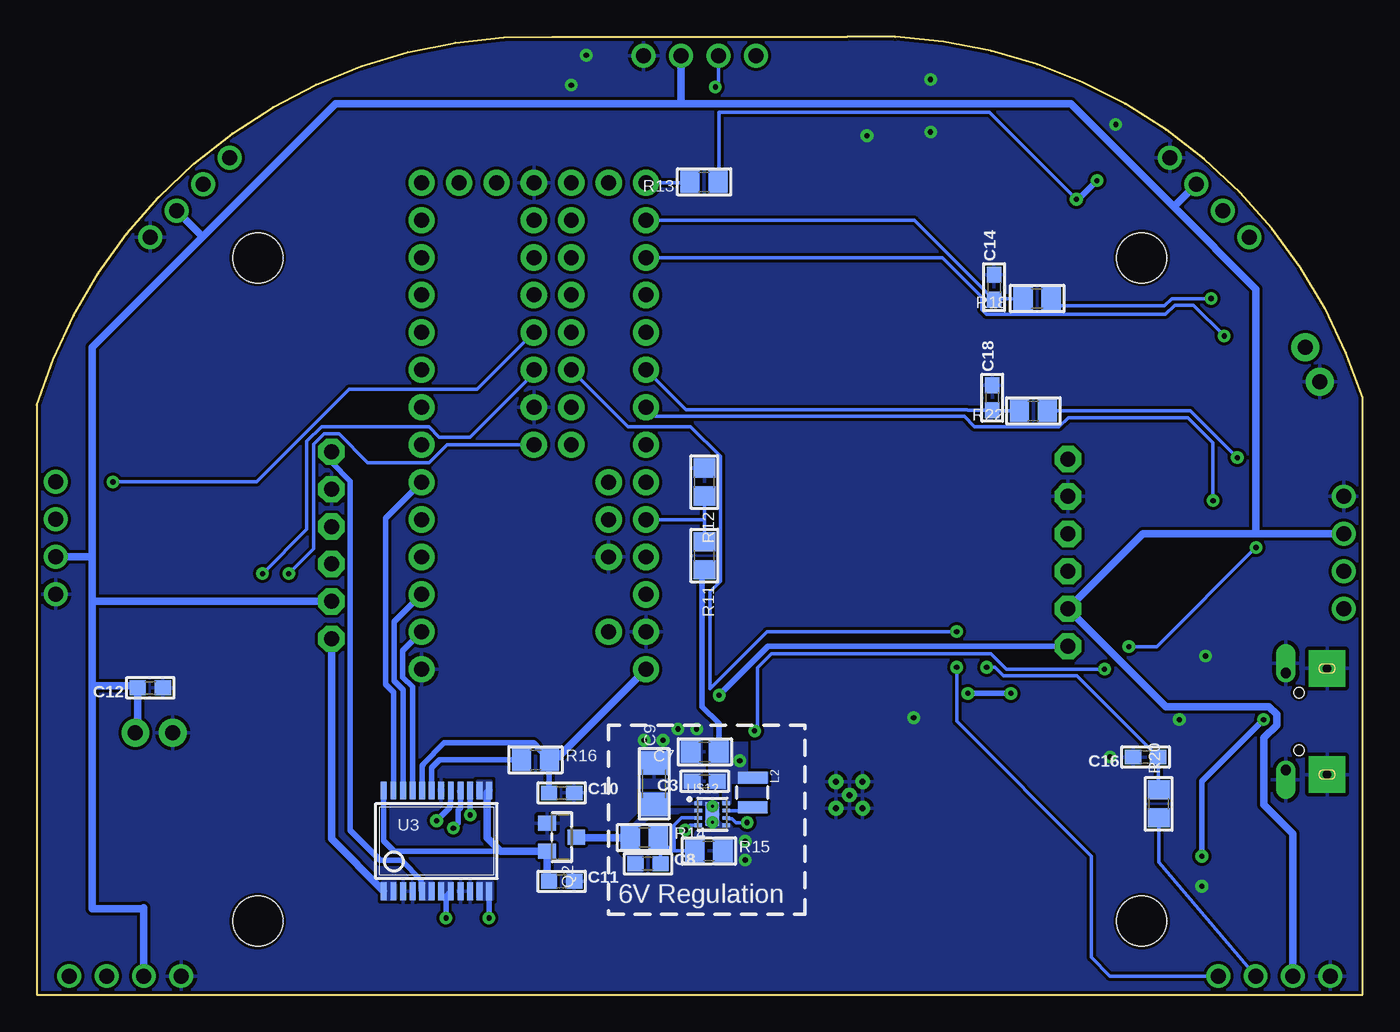
[diagram p5: board, bottom side, seen from below]

Size 90 x 65 mm. Coordinates in mm from the lower left corner, seen from the top.
Outline: 90,0 0,0 0,40.5 arc-75 35,65 55,65 arc-75 90,40 90,0
Copper layers (1*16): Top 0.035mm / dielectric 1.5mm / Bottom 0.035mm
Design rules "SparkFun *": minimum track width 8mil, minimum drill 0.15mm, track to track 8mil, track to pad 8mil, pad to pad 8mil, via to via 8mil, smd to smd 8mil, copper to edge 8mil, drill to drill 8mil, minimum pad ring 12mil, minimum via ring 10mil, stop-mask expansion 4mil, vias tented up to drill 20mil, thermal gap 10mil

### Footprints (pad centres in the part's own frame; a part is rotated, then mirrored left to right if it is on the bottom)
JSTPH2 = smd 1 x 4.6: 1 -1,-3.7; 2 1,-3.7 | smd 1.6 x 3.4: NC1 -3.4,1.5; NC2 3.4,1.5
0603 = smd 1.1 x 1: 1 -0.85,0; 2 0.85,0
0805 = smd 1.3 x 1.5: 1 -0.95,0; 2 0.95,0
EIA3528-21/B-R = smd 1.95 x 2.5: + 1.525,0; - -1.525,0
1206 = smd 1.6 x 1.8: 1 -1.4,0; 2 1.4,0
1X02 = drill 1.016 pad 1.88: 1 0,0; 2 2.54,0
VISHAY_IHLP2525CZER6R8M01 = smd 2.413 x 3.429: P$1 -2.921,0; P$2 2.921,0
MURATA_DFE252012P-1R5M=P2 = smd 0.8 x 2: P$1 -1,0; P$2 1,0
CHIPLED_0805_NOOUTLINE = smd 1.2 x 1.2: A 0,-1.05; C 0,1.05
1X06-CLEANBIG = drill 1.016 pad 1.778 octagon: 1 -6.35,0; 2 -3.81,0; 3 -1.27,0; 4 1.27,0; 5 3.81,0; 6 6.35,0
SC59-BEC = smd 1 x 1.4: B -0.95,-1.2; C 0,1.2; E 0.95,-1.2
SOT23-WIDE = smd 1 x 1.2: 1 -0.95,-1; 2 0.95,-1; 3 0,1
PVQFN-16 = smd 1.05 x 0.35: 1 -2.1,0.975; 2 -2.1,0.325; 3 -2.1,-0.325; 4 -2.1,-0.975; 9 2.1,-0.975; 10 2.1,-0.325; 11 2.1,0.325; 12 2.1,0.975 | smd 0.35 x 1.05: 5 -0.975,-2.1; 6 -0.325,-2.1; 7 0.325,-2.1; 8 0.975,-2.1; 13 0.975,2.1; 14 0.325,2.1; 15 -0.325,2.1; 16 -0.975,2.1 | drill 0.4: P$18 0,0; P$19 -0.9,0.9; P$20 0.9,0.9; P$21 0.9,-0.9; P$22 -0.9,-0.9 | smd 2.7 x 2.7: THERMAL 0,0
SOT23-5 = smd 0.55 x 1.2: 1 -0.95,-1.3; 2 0,-1.3; 3 0.95,-1.3; 4 0.95,1.3; 5 -0.95,1.3
SSOP24 = smd 0.4 x 1.2: 1 -3.575,-3.42; 2 -2.925,-3.42; 3 -2.275,-3.42; 4 -1.625,-3.42; 5 -0.975,-3.42; 6 -0.325,-3.42; 7 0.325,-3.42; 8 0.975,-3.42; 9 1.625,-3.42; 10 2.275,-3.42; 11 2.925,-3.42; 12 3.575,-3.42; 13 3.575,3.42; 14 2.925,3.42; 15 2.275,3.42; 16 1.625,3.42; 17 0.975,3.42; 18 0.325,3.42; 19 -0.325,3.42; 20 -0.975,3.42; 21 -1.625,3.42; 22 -2.275,3.42; 23 -2.925,3.42; 24 -3.575,3.42
M3_SCREW = hole 3.4: 0,0
TPS61252 = smd 0.5 x 0.25: 1 -0.95,0.75; 2 -0.95,0.25; 3 -0.95,-0.25; 4 -0.95,-0.75; 5 0.95,-0.75; 6 0.95,-0.25; 7 0.95,0.25; 8 0.95,0.75 | drill 0.2 pad 0.406: P$2_GND 0,0.55; P$3_GND 0,-0.55 | smd 0.9 x 1.6: THERMAL_GND 0,0
TEENSY3_2 = drill 1.016 pad 1.778: 3.3V -2.54,-15.24; 3.3V2 2.54,0; 3.3V(250MA) 7.62,12.7; A10 5.08,7.62; A11 5.08,5.08; A12 0,2.54; A13 2.54,2.54; A14 5.08,-15.24; AGND 7.62,15.24; AREF 5.08,10.16; D0 -7.62,15.24; D1 -7.62,12.7; D2 -7.62,10.16; D3 -7.62,7.62; D4 -7.62,5.08; D5 -7.62,2.54; D6 -7.62,0; D7 -7.62,-2.54; D8 -7.62,-5.08; D9 -7.62,-7.62; D10 -7.62,-10.16; D11 -7.62,-12.7; D12 -7.62,-15.24; D13 7.62,-15.24; D14 7.62,-12.7; D15 7.62,-10.16; D16 7.62,-7.62; D17 7.62,-5.08; D18 7.62,-2.54; D19 7.62,0; D20 7.62,2.54; D21 7.62,5.08; D22 7.62,7.62; D23 7.62,10.16; D24 0,-2.54; D25 0,-5.08; D26 0,-7.62; D27 0,-10.16; D28 0,-12.7; D29 2.54,-12.7; D30 2.54,-10.16; D31 2.54,-7.62; D32 2.54,-5.08; D33 2.54,-2.54; GND -7.62,17.78; GND2 0,-15.24; GND3 0,0; PROG 2.54,-15.24; VBAT -5.08,-15.24; VIN 7.62,17.78; VUSB 5.08,15.24
SHARP_IR_4PIN = drill 1.016: EN 3.81,1.27; GND -3.81,1.27; OUT 1.27,1.27; VCC -1.27,1.27
4UCONN_20329 = smd 1 x 2: BASE@1 -0.75,-2; BASE@2 0.75,-2 | smd 0.4 x 1.35: D+ 0,0.775; D- -0.65,0.775; GND 1.3,0.775; ID 0.65,0.775; VBUS -1.3,0.775 | drill 0.7 offset: SPRT@1 -3.3,0.9; SPRT@2 3.3,0.9 | drill 0.6 pad 2.5 square: SPRT@3 -3.6,-1.9; SPRT@4 3.6,-1.9 | hole 0.7: -1.95,0; 1.95,0

### Placement (x,y rotation side)
B1  3.51,8.37 90 top
C1  32.95,8.54 0 top
C2  30.85,14.46 270 top
C3  44.66,14.48 180 bottom
C4  32.95,6.54 0 top
C5  28.11,17.3 270 top
C6  9.65,21.59 0 top
C7  44.66,16.48 180 bottom
C8  48.51,8.89 0 bottom
C9  48.1,14.32 90 bottom
C10  54.37,13.69 0 bottom
C11  54.37,7.69 0 bottom
C12  82.3,20.83 180 bottom
C13  51.18,60.71 0 top
C14  25.02,48.01 90 bottom
C15  69.85,53.34 270 top
C16  14.73,16.13 180 bottom
C17  84.33,7.62 180 top
C18  25.15,40.51 90 bottom
C19  80.52,32.89 90 top
J1  3.9,43.94 247.2 top
J2  83.31,17.78 180 top
L1  25.84,9.03 90 top
L2  41.4,13.72 270 bottom
LBO  27.79,63.48 280.7 top
LED3  23.68,62.3 109.9 top
LED4  19.76,60.4 122.2 top
MOTORL  20,30 90 top
MOTORR  70,30.5 90 top
PWR  32.13,64.01 274.7 top
Q1  38.88,23.89 0 top
Q2  54.37,10.69 270 bottom
R1  39.47,9.81 270 top
R2  39.47,13.81 270 top
R3  33.98,18.91 270 top
R4  36.48,18.91 90 top
R5  33.62,61.08 270 top
R6  23.24,58.86 270 top
R7  20.21,57.08 270 top
R8  9.65,15.75 0 top
R9  39.7,18.93 270 top
R10  27.27,60.23 270 top
R11  44.69,29.79 270 bottom
R12  44.69,34.79 270 bottom
R13  44.7,55.15 180 bottom
R14  48.77,10.67 0 bottom
R15  44.39,9.75 0 bottom
R16  56.15,15.94 0 bottom
R17  47.37,60.71 0 top
R18  22.1,47.24 180 bottom
R19  72.77,54.1 180 top
R20  13.84,12.95 90 bottom
R21  85.22,4.7 90 top
R22  22.35,39.62 180 bottom
R23  83.31,32.26 180 top
U1  34.84,13.55 0 top
U2  9.65,18.8 90 top
U3  62.87,10.44 0 bottom
U$1  [M3_SCREW]  15,50 0 top
U$2  [M3_SCREW]  75,50 0 top
U$3  [M3_SCREW]  15,5 0 top
U$4  [M3_SCREW]  75,5 0 top
U$12  44.14,12.25 0 bottom
U$28  56.26,39.86 180 top
U$43  45,65 180 top
U$44  9.5,55 225 top
U$45  80.5,55 135 top
U$46  6,0 0 top
U$47  84,0 0 top
U$48  0,30 270 top
U$49  90,31 90 top
X2  4.32,18.54 270 top

### Tracks (layer width: path | path; a pad name or v marks a point on that pad's centre or on a via)
5.0V
  Top 0.381: 24.43,21.76 23.94,21.27 23.54,21.27 23.3,21.03 12.91,21.03 12.91,46.06 13.02,46.16 16.59,46.16 18.84,48.41 18.84,51.59 18.62,51.81 18.62,51.83 19.36,52.57 26.02,52.57 31.09,57.63 PWR.A 30.71,63.92
  Top 0.508: MOTORL.2 24.43,21.76 25.4,20.79 25.4,15.75 28.07,15.75 C5.+ | U$28.VIN 49.43,22.08 61.1,10.42 62.72,10.42 65.23,12.92 65.23,21.92 MOTORR.2
  Bottom 0.381: C10.1 55.22,15.92 R16.2 55.38,16.12 56.05,16.8 56.05,16.85 56.29,17.08 62.35,17.08 63.78,15.66 63.78,15.62 63.85,15.55 U3.20
  Bottom 0.508: 7.24,31.27 8.26,31.27 14.92,31.27 MOTORL.2 13.37,19.55 6.36,19.55 5.84,19.04 5.84,18.3 6.7,17.45 6.7,12.89 4.73,10.92 U$46.VCC | 7.24,31.27 U$48.VCC | 86.23,29.72 86.23,26.67 | 86.23,26.67 86.23,20.95 | 86.23,20.95 86.23,5.84 82.8,5.84 82.73,5.92 U$47.VCC | U$43.VCC 46.27,60.49 46.23,60.45 | 78.74,51.44 U$45.VCC | U$49.VCC 86.25,29.73 86.23,29.72 | 86.23,20.95 83.27,20.95 C12.2 83.15,17.95 J2.1 | MOTORR.2 86.21,26.69 86.23,26.67 | U$28.VIN 54.6,16.12 55.38,16.12 | 78.74,51.44 69.73,60.45 46.23,60.45 | 78.74,51.44 86.23,43.95 86.23,29.72 | U$44.VCC 12.83,53.47 | 12.83,53.47 7.24,47.88 7.24,31.27 | 12.83,53.47 19.81,60.45 46.23,60.45
  pour Top (no thermals): 34.58,15.33 34.58,18.5 33.31,18.5 33.31,15.96 29.62,15.96 29.62,14.82 31.91,14.82 32.29,14.44 33.05,14.44 33.05,15.08 33.31,15.33
  pour Top (no thermals): 26.96,16.73 26.96,14.82 29.62,14.82 29.62,15.96 28.86,16.73
6.0V
  Bottom 0.508: R14.1 53.34,10.67 Q2.3
  pour Bottom (no thermals): 44.83,12.57 47.24,12.57 47.24,13.72 49.02,13.72 49.02,12.06 49.66,11.43 50.29,11.43 50.29,9.78 49.91,9.4 49.91,8.38 48.9,8.38 48.9,9.65 49.15,9.91 49.15,11.3 48.39,12.06 47.24,12.06 47.24,12.32 44.83,12.32
BATTERY_VOLTAGE_MEASURE
  Bottom 0.254: R12.2 44.69,32.26 | 44.69,32.26 R11.1 | U$28.D22 44.7,32.24 44.69,32.26
CHARGING_BOOL_5V  (via drill 0.35)
  Top 0.381: X2.VBUS 7.37,19.84 | 7.37,19.84 8.26,19.84 U2.4 | 7.37,19.84 7.37,20.15 C6.1 8.8,23.28 9.47,23.95 11.16,23.95 11.16,51.59 13.41,53.84 16.63,53.84 v18.03,55.24 | 24.39,62.38 LED3.A 24.67,57.38 22.38,55.09 20.54,55.09 v19.43,53.98
  Bottom 0.254: v19.43,53.98 25.32,59.87 43.69,59.87 43.69,55.22 R13.1
  Bottom 0.381: v18.03,55.24 19.3,53.98 v19.43,53.98
CHG_5V
  Bottom 0.254: R13.2 45.7,55.1 U$28.D13
EN_IRBL  (via drill 0.35)
  Top 0.254: v27.56,24.64 v27.56,22.23
  Bottom 0.254: U$46.EN 17.14,1.27 18.41,2.54 18.41,9.4 27.56,18.54 v27.56,22.23 | v27.56,24.64 40.44,24.64 44.31,20.77 44.31,27.35 43.6,28.05 43.6,36.53 45.62,38.54 49.86,38.54 U$28.D33
EN_IRBR  (via drill 0.35)
  Top 0.254: v74.68,28.57 83.74,19.51 84.03,19.51 87.81,15.72 U$47.EN
  Bottom 0.254: v74.68,28.57 71.68,31.57 71.68,37.54 70.68,38.54 63.38,38.54 62.68,37.85 60.58,37.85 56.26,42.16 U$28.D24
EN_IRF
  Top 0.254: U$28.D12 56.5,62.48 42.44,62.48 U$43.EN
EN_IRFL  (via drill 0.35)
  Top 0.254: U$44.EN 9.4,49.71 v9.4,44.7
  Bottom 0.254: v9.4,44.7 11.48,46.79 12.77,46.79 13.39,46.16 25.54,46.16 25.85,46.47 25.85,47.34 28.53,50.02 U$28.D15
EN_IRFR
  Top 0.254: U$45.EN 66.19,56.8 65.1,55.7 65.1,54.6 64.39,53.88 63.28,53.88 63.25,53.85 57.54,53.85 U$28.D28
EN_IRL  (via drill 0.35)
  Top 0.254: U$48.EN 4.22,29.14 7.74,29.14 8.97,30.36 8.97,32.33 v10.16,33.53
  Bottom 0.254: v10.16,33.53 10.16,37.45 11.87,39.17 19.99,39.17 20.61,38.54 26.34,38.54 27.05,39.26 48.03,39.26 U$28.D19
EN_IRR  (via drill 0.35)
  Top 0.254: U$49.EN 88.72,34.8 v84.84,34.8
  Bottom 0.254: v84.84,34.8 75.07,34.8 68.78,41.08 60.12,41.08 U$28.D25
ENABLE  (via drill 0.35)
  Top 0.254: 39.7,16.63 R9.2 | 39.7,16.63 38.81,15.74 38.58,15.74 38.39,15.55 38.39,14.51 37.72,13.84 36.98,13.84 U1.11 | 39.7,16.63 41.78,14.54 v41.78,11.68 | v17.53,22.1 17.4,22.1 v15.88,23.62 | v7.24,30.35 7.24,40.6 J1.1
  Top 0.508: R9.2 39.77,17.91 v41.27,17.91
  Bottom 0.254: U$12.6 43.15,11.96 42.81,11.96 42.54,11.68 v41.78,11.68 | v15.88,23.62 13.97,23.62 v7.24,30.35 | v17.53,22.1 24.2,22.1 25.23,23.13 40.14,23.13 41.1,22.17 41.1,18.09 v41.27,17.91
ENCAL
  Top 0.508: MOTORL.3 20,29.37 17.94,31.42 17.94,37.2 19.15,38.41 20.85,38.41 21.94,37.32 U$28.D20
ENCAR
  Top 0.381: MOTORR.3 64.35,29.23 U$28.D2
ENCBL
  Top 0.508: MOTORL.4 20,31.91 18.65,33.25 18.65,36.91 19.44,37.7 20.56,37.7 23.47,34.78 U$28.D21
ENCBR
  Top 0.381: MOTORR.4 64.35,31.77 U$28.D3
GND  (via drill 0.35)
  Top 0.254: U1.10 37.93,13.22 R2.1
  other vias: 10.92,7.37 45.21,18.03 46.48,18.03 47.5,17.27 48.77,17.27 41.91,10.41 41.91,9.14 16.76,59.05 29.34,62.1 52.7,63.75 53.72,61.72 12.45,18.67 17.14,16.13 33.66,58.29 29.34,58.55 30.48,18.8 10.67,22.99
  pour Top (no thermals): 35.21,11.85 33.81,11.85 33.81,9.36 33.33,9.36 33.33,5.8 34.53,5.8 34.53,10.99 35.21,10.99
  pour Top (no thermals): 35.24,11.9 33.61,11.9 33.61,14.85 35.77,14.85 35.77,16.04 35.95,16.04 35.95,14.87 36.13,14.87 36.13,12.26 35.24,12.26
  pour Top (no thermals): 37.4,13.32 36.13,13.32 36.13,13.17 37.4,13.17
  pour Bottom (rank 4): -0.89,-1.14 91.57,-1.14 91.57,0.64 91.57,66.29 91.19,66.29 -0.89,66.29
  pour Top (rank 4): -1.4,-1.4 91.06,-1.4 91.06,0.38 91.06,66.04 90.68,66.04 -1.4,66.04
  pour Bottom (no thermals): 44.7,18.54 49.28,18.54 49.28,14.99 47.24,14.99 46.23,13.97 45.21,13.97 45.21,12.95 44.45,12.95 44.45,11.43 43.94,11.43 43.94,8.64 41.4,8.64 41.4,10.92 42.42,10.92 42.93,11.43 42.93,11.56 43.81,11.56 43.81,13.08 44.83,13.08 44.83,18.41
IRBL  (via drill 0.35)
  Top 0.254: U$28.A13 50.36,37.32 49.15,38.54 21.54,38.54 21.09,38.99 18.91,38.99 17.36,37.44 17.36,29.65 19.5,27.51 20.4,27.51 21.22,26.7 21.22,26.53 v25.53,22.23
  Bottom 0.254: R20.2 13.88,13.94 C16.1 19.39,21.64 24.39,21.64 24.97,22.23 v25.53,22.23
IRBR  (via drill 0.35)
  Top 0.254: R21.2 85.22,7.58 C17.1 85.18,17.71 83.84,19.05 82.42,19.05 v72.9,28.57
  Bottom 0.254: v72.9,28.57 71.22,30.25 71.22,37.35 70.5,38.07 69.5,38.07 67.53,36.1 63.38,36.1 62.16,37.32 U$28.A12
IRF
  Top 0.254: R17.2 C13.1 51.18,59.86 U$28.A14
IRFL
  Bottom 0.254: R18.2 24.93,47.24 C14.1 30.43,52.56 U$28.D14
IRFR
  Top 0.254: R19.2 69.94,54.1 C15.1 68.33,52.67 65.71,52.67 64.39,51.34 63.38,51.34 62.05,52.67 58.9,52.67 U$28.D27
IRL
  Bottom 0.254: 23.39,39.71 R22.2 25.11,39.62 C18.1 26.81,39.66 26.86,39.71 45.95,39.71 U$28.D18
IRR
  Top 0.254: R23.2 80.73,32.26 C19.1 71.7,32.04 70.65,33.09 69.5,33.09 65.1,37.49 65.1,45.45 64.39,46.16 57.58,46.16 U$28.D26
LBO
  Top 0.381: Q1.B 37.94,15.83 37.87,15.77 37.87,14.73 37.66,14.53 U1.12
LMIN1  (via drill 0.35)
  Top 0.381: v62.87,11.81 62.87,21.29 62.6,21.55 62.6,41.12 U$28.D7
  Bottom 0.381: U3.17 61.9,12.86 61.99,12.78 61.99,12.69 v62.87,11.81
LMIN2  (via drill 0.35)
  Top 0.381: U$28.D8 63.88,44.22 62.01,42.35 62.01,11.59 v61.72,11.3
  Bottom 0.381: 61.3,13.8 U3.16 61.25,12.69 61.4,12.53 61.4,11.62 v61.72,11.3
LMOUT+  (via drill 0.35)
  Top 0.381: v43.69,20.32 44.39,19.62 44.39,17.69 56.88,5.21 v59.31,5.21
  Bottom 0.381: MOTORL.1 40.36,23.65 v43.69,20.32 | v59.31,5.21 U3.12
  pour Bottom (no thermals): 60.07,7.62 60.07,6.48 59.05,6.48 59.05,7.62
LMOUT-  (via drill 0.35)
  Top 0.381: v62.23,5.21 60.47,5.21 59.65,4.38 55.91,4.38 42.81,17.49 42.81,22.92 39.55,26.18 30.17,26.18 MOTORL.6
  Bottom 0.381: U3.8 62.23,6.69 v62.23,5.21
  pour Bottom (no thermals): 61.85,7.62 61.85,6.48 62.61,6.48 62.61,7.62
N$1
  pour Top (no thermals): 23.4,13.43 23.4,10.88 31.4,10.88 33.05,12.54 33.05,13.3 32.29,13.3 31.53,12.54 28.23,12.54 28.23,13.43
N$2
  Top 0.381: R10.1 26.76,61.69 LBO.A
N$3
  Top 0.254: R1.1 39.47,11.81 | 39.47,11.81 R2.2 | U1.9 37.71,11.81 39.47,11.81
N$4
  Top 0.381: R5.1 33.18,62.47 PWR.C
N$5
  Top 0.254: R3.1 35.18,19.86 | 35.18,19.86 R4.2 | 35.18,19.86 U1.14
N$6
  Top 0.381: R6.1 22.69,60.36 LED3.C
N$7
  Top 0.381: R6.2 R7.2 17.33,53.25 13.65,53.25 11.75,51.35 11.75,20.38 12.64,19.49 12.79,19.49 13.27,19.01 13.27,18.33 12.79,17.85 U2.1 | U2.1
N$8
  Top 0.381: U2.5 8.35,16.1 R8.1
N$9
  Top 0.381: R7.1 20.65,58.47 LED4.A
N$10  (via drill 0.35)
  Top 0.381: Q1.C 34.23,25.09 31.56,22.42 31.5,22.35 29.59,20.45 v26.8,20.45 | v23.88,20.45 12.51,20.45 12.33,20.63 12.33,46.37 12.71,46.75 16.35,46.75 18.25,48.65 18.25,51.35 18.03,51.57 18.03,52.07 19.12,53.15 21.27,53.15 25.25,57.14 25.25,57.26 R10.2
  Bottom 0.381: v26.8,20.45 v23.88,20.45
N$11
  Bottom 0.254: U$12.7 41.62,12.5 L2.P$2
N$12
  Bottom 0.254: C8.2 47.66,10.51 R14.2 46.9,9.75 46.74,9.75 | 46.74,9.75 R15.1 | U$12.3 46.22,12 46.74,11.49 46.74,9.75
N$14
  Top 0.254: U$49.OUT 84.27,32.27 R23.1
N$16  (via drill 0.35)
  Top 0.254: U$48.OUT 2.13,29.59 7.55,29.59 8.51,30.55 v8.51,36.45
  Bottom 0.254: v8.51,36.45 11.68,39.62 R22.1
N$19
  Top 0.254: U$47.OUT 85.27,3.7 R21.1
N$22
  Bottom 0.254: R20.1 13.84,8.99 U$46.OUT
N$26
  Top 0.254: U$45.OUT 77.81,54.1 R19.1
N$29  (via drill 0.35)
  Top 0.254: U$44.OUT 10.29,52.42 v10.29,47.24
  Bottom 0.254: v10.29,47.24 12.95,47.24 13.46,46.74 20.64,46.74 R18.1
N$32  (via drill 0.35)
  Top 0.254: R17.1 44.7,60.71 43.94,61.47 v43.94,61.59
  Bottom 0.254: U$43.OUT 43.73,61.81 v43.94,61.59
PWML  (via drill 0.35)
  Top 0.381: U$28.D23 48.64,28.98 52.46,25.16 52.46,20.31 v60.58,12.19
  Bottom 0.381: U3.15 60.6,12.21 v60.58,12.19
PWMR
  Bottom 0.381: U3.23 65.8,20.54 66.33,21.07 66.33,32.33 U$28.D4
RMIN1
  Bottom 0.381: U3.21 64.5,20.89 65.16,21.55 65.16,23.34 U$28.D0
RMIN2
  Bottom 0.381: U3.22 65.15,20.71 65.75,21.31 65.75,25.3 U$28.D1
RMOUT+
  Bottom 0.508: U3.1 70,10.57 MOTORR.1
  pour Bottom (no thermals): 65.66,7.62 65.66,6.48 66.55,6.48 66.55,7.62
RMOUT-
  Bottom 0.381: U3.5 63.9,7.08 63.9,7.78 65.25,9.13 66.69,9.13 68.72,11.16 68.72,34.84 70,36.12 MOTORR.6
  pour Bottom (no thermals): 63.12,7.62 63.12,6.48 63.88,6.48 63.88,7.62
STBY
  Bottom 0.381: R16.1 62.67,15.94 63.2,15.41 U3.19
VBAT  (via drill 0.35)
  Top 0.254: v45.97,11.18 45.97,13.59 44.2,13.59 v42.29,15.88 42.29,18.92 41.53,19.68 39.89,19.68 R9.1 | U1.8 35.82,9.39 36.35,8.86 R1.2
  Top 0.381: U2.3 9.78,19.75 9.12,19.08 7.14,19.08 v6.73,18.67 | 39.84,20.02 R9.1 39.7,22.55 Q1.E
  Top 0.508: 39.47,7.37 40.36,8.26 42.28,8.26 45.2,11.18 v45.97,11.18
  Top 1.016: B1.2 10.9,9.37 v10.92,9.4 18.03,9.4 21.34,6.1 25.83,6.1 L1.P$1 | C4.1 32,4.57 32.51,4.06 38.61,4.06 39.47,4.93 39.47,7.37 R1.2
  Bottom 0.254: U$12.4 45.65,11.5 v45.97,11.18
  Bottom 0.381: v6.73,18.67 10.92,14.48 v10.92,9.4 | C7.1 43.71,18.43 44.83,19.56 44.83,28.7 R11.2
  pour Top (no thermals): 32.67,9.23 29.11,9.23 27.59,7.71 24.04,7.71 24.04,4.66 30.13,4.66 31.15,5.68 32.67,5.68
  pour Bottom (no thermals): 43.43,12.95 43.43,14.35 42.93,14.35 42.93,12.95
  pour Bottom (no thermals): 44.32,17.14 41.78,17.14 41.78,15.11 40.39,15.11 40.39,14.35 42.93,14.35 43.31,13.97 44.32,13.97
VMOTOR
  Bottom 0.381: U3.24 66.45,10.44 65.75,9.74 58.51,9.74
  Bottom 0.508: C11.1 55.37,7.84 Q2.2 58.51,9.74 59.44,10.67 59.44,13.72 U3.13
  pour Bottom (no thermals): 60.07,13.34 60.07,14.48 59.18,14.48 59.18,13.34

### Text on the board
tPlace: GRITSBOT X / V1.0 | GND | + | 5V Regulation
bPlace: 6V Regulation